# EAGLE design Zuno (EAGLE 8.2.2)
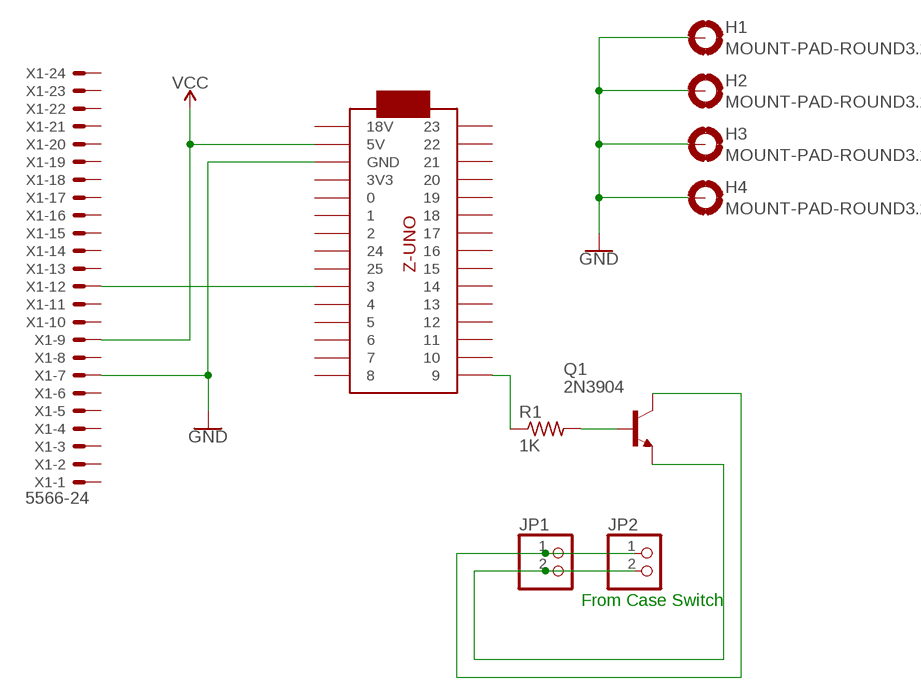
[diagram p0: schematic, sheet 1]

## Parts
H1  MOUNT-PAD-ROUND3.2  [3,2-PAD]
H2  MOUNT-PAD-ROUND3.2  [3,2-PAD]
H3  MOUNT-PAD-ROUND3.2  [3,2-PAD]
H4  MOUNT-PAD-ROUND3.2  [3,2-PAD]
JP1  PINHD-1X2  [1X02]
JP2  PINHD-1X2  [1X02]
Q1  2N3904  [TO92]
R1  1K  R-US_0207/10  [0207/10]
U$1  ZUNO  [ZUNO]
X1  5566-24  [5566-24]

## Nets
GND: H1.B3,2(MOUNT) H2.B3,2(MOUNT) H3.B3,2(MOUNT) H4.B3,2(MOUNT) U$1.P$3(GND) X1.7
N$3: U$1.P$10 X1.12
N$4: R1.1 U$1.P$16
N$5: Q1.2(B) R1.2
N$7: JP1.2 JP2.2 Q1.3(E)
TOMOTHERBOARD: JP1.1 JP2.1 Q1.1(C)
VCC: U$1.P$2(5V) X1.9
Unconnected: U$1.P$1(18V) U$1.P$4(3V3) U$1.P$5 U$1.P$6 U$1.P$7 U$1.P$8 U$1.P$9 U$1.P$11 U$1.P$12 U$1.P$13 U$1.P$14 U$1.P$15 U$1.P$17 U$1.P$18 U$1.P$19 U$1.P$20 U$1.P$21 U$1.P$22 U$1.P$23 U$1.P$24 U$1.P$25 U$1.P$26 U$1.P$27 U$1.P$28 U$1.P$29 U$1.P$30 X1.1 X1.2 X1.3 X1.4 X1.5 X1.6 X1.8 X1.10 X1.11 X1.13 X1.14 X1.15 X1.16 X1.17 X1.18 X1.19 X1.20 X1.21 X1.22 X1.23 X1.24

## Notes on the sheet
- From Case Switch

## Library data of the parts
H1-H4 = holes:MOUNT-PAD-ROUND: MOUNTING PAD, round
JP1 JP2 = pinhead:PINHD-1X2: PIN HEADER
Q1 = transistor-npn:2N3904: NPN Transistor
R1 = resistor:R-US_: RESISTOR, American symbol
U$1 = adafruit:ZUNO
X1 = con-molex:5566-24: Mini FIT connector 24 pol Source: http://www.molex.com; OC_FARNELL: unknown; OC_NEWARK: unknown

## Board
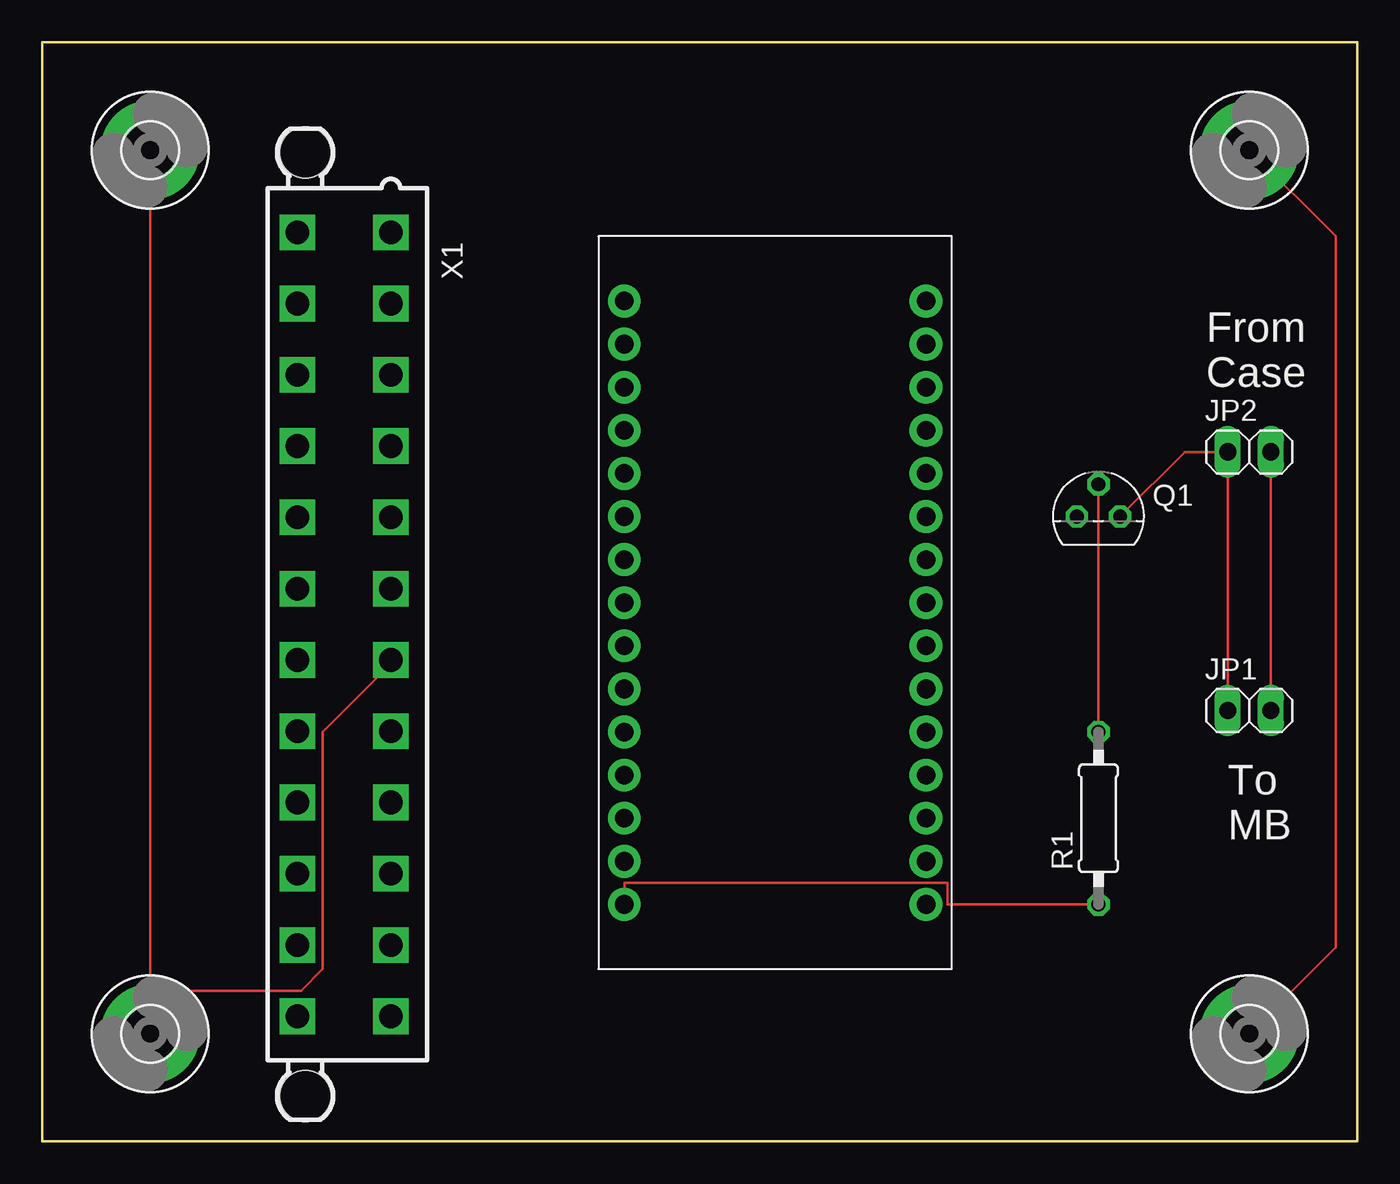
[diagram p1: board, top side]
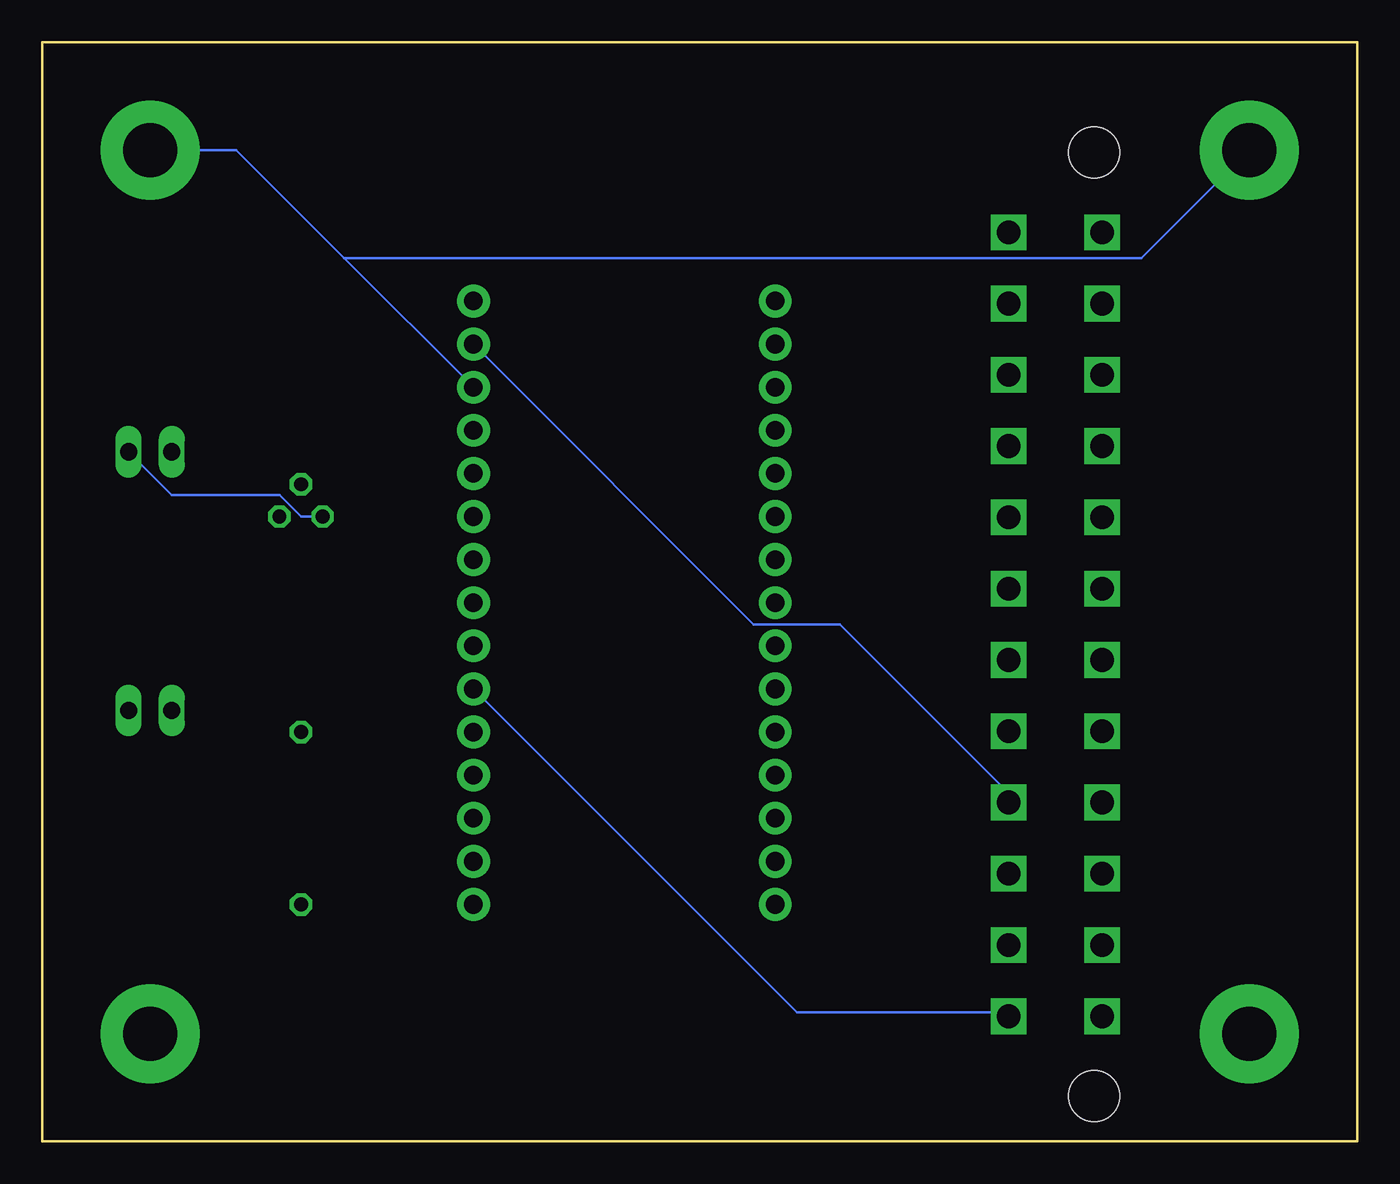
[diagram p2: board, bottom side, seen from below]

Size 77.47 x 64.77 mm. Coordinates in mm from the lower left corner, seen from the top.
Outline: 0,0 0,64.77 77.47,64.77 77.47,0 0,0
Copper layers (1*16): Top 0.035mm / dielectric 1.5mm / Bottom 0.035mm
Design rules "default": minimum track width 6mil, minimum drill 0.35mm, track to track 6mil, track to pad 6mil, pad to pad 6mil, via to via 6mil, smd to smd 6mil, copper to edge 40mil, drill to drill 6mil, minimum pad ring 10mil, minimum via ring 8mil, stop-mask expansion 4mil, vias tented up to drill 0mil, thermal gap 10mil

### Footprints (pad centres in the part's own frame; a part is rotated, then mirrored left to right if it is on the bottom)
3,2-PAD = drill 3.2 pad 5.842: B3,2 0,0
1X02 = drill 1.016 long: 1 -1.27,0; 2 1.27,0
TO92 = drill 0.813 octagon: 1 1.27,0; 2 0,1.905; 3 -1.27,0
0207/10 = drill 0.813 octagon: 1 -5.08,0; 2 5.08,0
ZUNO = drill 1.1 pad 1.93: P$1 -20.32,7.62; P$2 -17.78,7.62; P$3 -15.24,7.62; P$4 -12.7,7.62; P$5 -10.16,7.62; P$6 -7.62,7.62; P$7 -5.08,7.62; P$8 -2.54,7.62; P$9 0,7.62; P$10 2.54,7.62; P$11 5.08,7.62; P$12 7.62,7.62; P$13 10.16,7.62; P$14 12.7,7.62; P$15 15.24,7.62; P$16 15.24,-10.16; P$17 12.7,-10.16; P$18 10.16,-10.16; P$19 7.62,-10.16; P$20 5.08,-10.16; P$21 2.54,-10.16; P$22 0,-10.16; P$23 -2.54,-10.16; P$24 -5.08,-10.16; P$25 -7.62,-10.16; P$26 -10.16,-10.16; P$27 -12.7,-10.16; P$28 -15.24,-10.16; P$29 -17.78,-10.16; P$30 -20.32,-10.16
5566-24 = drill 1.4 square: 1 23.1,-2.75; 2 18.9,-2.75; 3 14.7,-2.75; 4 10.5,-2.75; 5 6.3,-2.75; 6 2.1,-2.75; 7 -2.1,-2.75; 8 -6.3,-2.75; 9 -10.5,-2.75; 10 -14.7,-2.75; 11 -18.9,-2.75; 12 -23.1,-2.75; 13 23.1,2.75; 14 18.9,2.75; 15 14.7,2.75; 16 10.5,2.75; 17 6.3,2.75; 18 2.1,2.75; 19 -2.1,2.75; 20 -6.3,2.75; 21 -10.5,2.75; 22 -14.7,2.75; 23 -18.9,2.75; 24 -23.1,2.75 | hole 3: 27.8,2.29; -27.8,2.29

### Placement (x,y rotation side)
H1  6.35,58.42 0 top
H2  6.35,6.35 0 top
H3  71.12,58.42 0 top
H4  71.12,6.35 0 top
JP1  71.12,25.4 0 top
JP2  71.12,40.64 0 top
Q1  62.23,36.83 0 top
R1  62.23,19.05 90 top
U$1  44.45,29.21 270 top
X1  17.78,30.48 90 top

### Tracks (layer width: path | path; a pad name or v marks a point on that pad's centre or on a via)
GND
  Top 0.152: 6.35,8.89 15.24,8.89 16.51,10.16 16.51,24.13 20.32,27.94 X1.7 | 6.35,8.89 H1.B3,2 | 6.35,8.89 H2.B3,2 | H4.B3,2 76.2,11.43 76.2,53.34 H3.B3,2
  Bottom 0.152: 59.69,52.07 66.04,58.42 H3.B3,2 | 59.69,52.07 U$1.P$3 | H1.B3,2 12.7,52.07 59.69,52.07
N$3
  Bottom 0.152: U$1.P$10 33.02,7.62 20.32,7.62 X1.12
N$4
  Top 0.152: R1.1 53.34,13.97 53.34,15.24 34.29,15.24 U$1.P$16
N$5
  Top 0.152: Q1.2 R1.2
N$7
  Top 0.152: JP2.2 JP1.2
  Bottom 0.152: Q1.3 62.23,36.83 63.5,38.1 69.85,38.1 JP2.2
TOMOTHERBOARD
  Top 0.152: Q1.1 67.31,40.64 JP2.1 JP1.1
VCC
  Bottom 0.152: U$1.P$2 35.56,30.48 30.48,30.48 20.32,20.32 X1.9

### Text on the board
tPlace: From / Case | To / MB